# Altium schematic sheet GSM_GPS.SchDoc
size A4
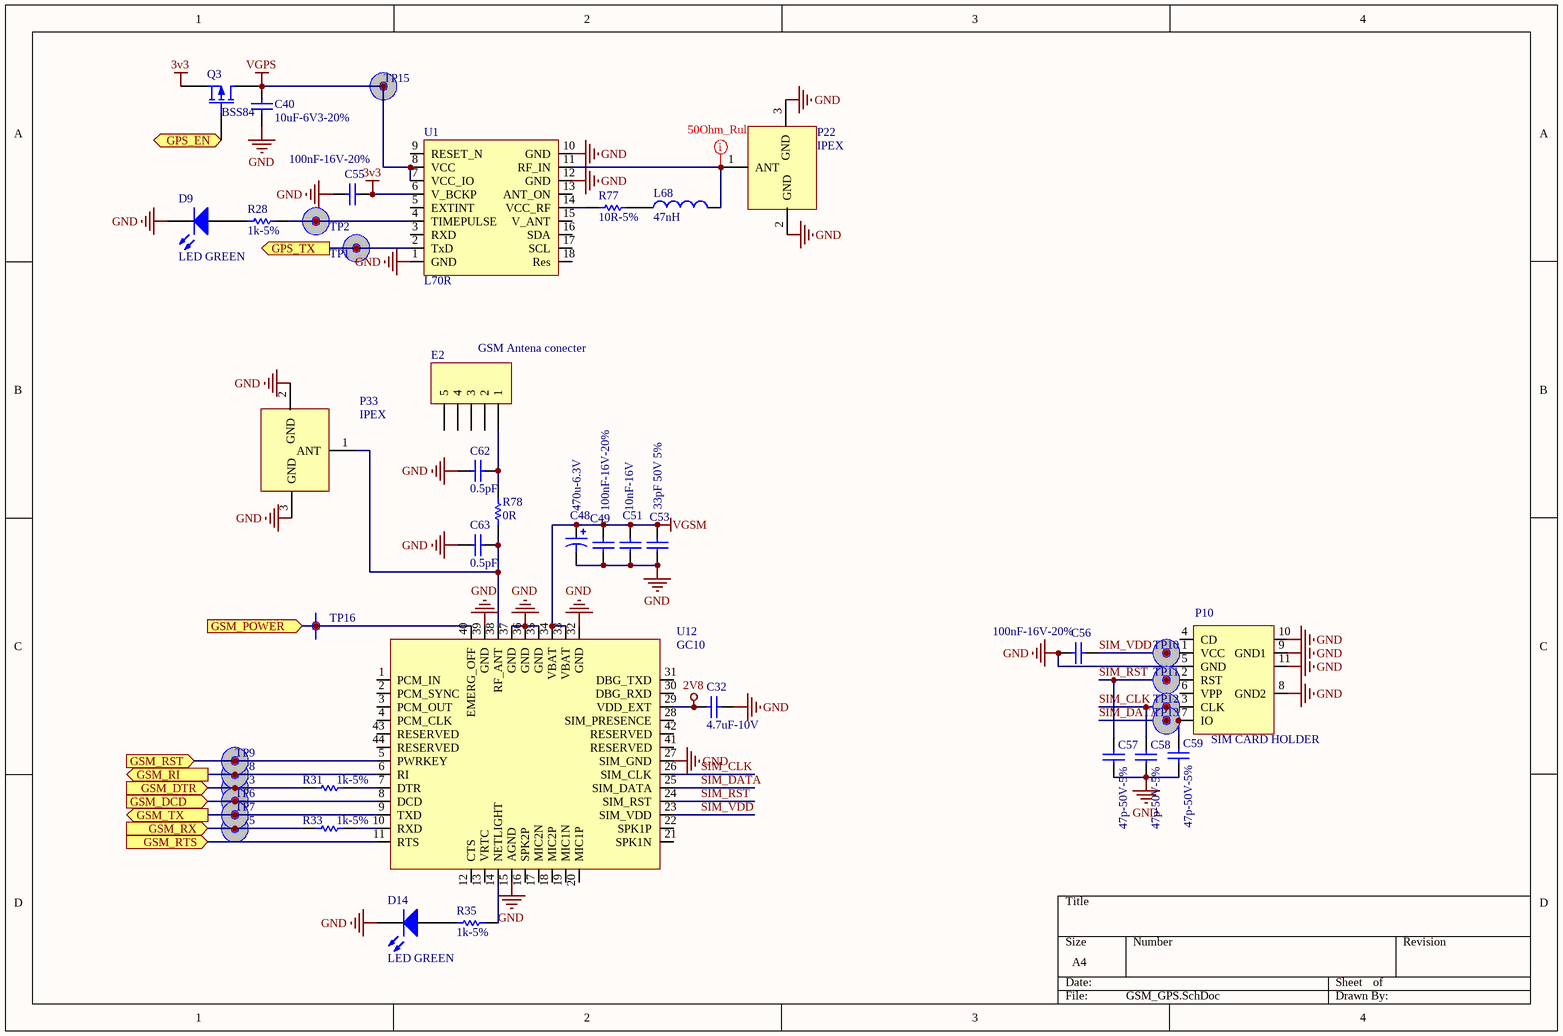
[diagram p0: GSM_GPS.SchDoc]

## Parts
C32  4.7uF-10V  [C0603]
C40  10uF-6V3-20%  [C0603]
C48  470u-6.3V  [C1812]
C49  100nF-16V-20%  [C0402]
C51  10nF-16V  [C0402]
C53  33pF 50V 5%  [C0402]
C55  100nF-16V-20%  [C0402]
C56  100nF-16V-20%  [C0402]
C57  47p-50V-5%  [C0402]
C58  47p-50V-5%  [C0402]
C59  47p-50V-5%  [C0402]
C62  0.5pF  [C0402]
C63  0.5pF  [C0402]
D9  LED GREEN  [LED0603-G]
D14  LED GREEN  [LED0603-G]
E2  GSM Antena conecter  [A10343-GSM850/900/1800/1900/WCDMA]
L68  47nH  [C0603]
P10  SIM CARD HOLDER  [SIM MF01-412-063X]
P22  IPEX  [IPEX]
P33  IPEX  [IPEX]
Q3  BSS84  [SOT23-3]
R28  1k-5%  [R0402]
R31  1k-5%  [R0402]
R33  1k-5%  [R0402]
R35  1k-5%  [R0402]
R77  10R-5%  [R0402]
R78  0R  [R0402]
TP1  TP  [test_point]  (value not drawn)
TP2  TP  [test_point]  (value not drawn)
TP3  TP  [test_point]  (value not drawn)
TP5  TP  [test_point]  (value not drawn)
TP6  TP  [test_point]  (value not drawn)
TP7  TP  [test_point]  (value not drawn)
TP8  TP  [test_point]  (value not drawn)
TP9  TP  [test_point]  (value not drawn)
TP10  TP  [test_point]  (value not drawn)
TP11  TP  [test_point]  (value not drawn)
TP12  TP  [test_point]  (value not drawn)
TP13  TP  [test_point]  (value not drawn)
TP15  TP  [test_point]  (value not drawn)
TP16  TP  [test_point]  (value not drawn)
U1  L70R  [MAX7]
U12  GC10  [GC10]

## Ports
GPS_EN (in), GPS_TX (out), GSM_DCD (in), GSM_DTR (in), GSM_POWER (in), GSM_RI (out), GSM_RST (in), GSM_RTS (in), GSM_RX (in), GSM_TX (out)

## Nets
2V8: C32.2 U12.29(VDD_EXT)
3v3: C55.1 Q3.2(S) U1.6(V_BCKP)
GND: C32.1 C40.1 C48.2 C49.2 C51.1 C53.2 C55.2 C56.2 C57.1 C58.1 C59.1 C62.1 C63.1 D9.2(K) D14.2(K) P10.5(GND) P10.8(GND2) P10.9(GND1) P10.10(GND3) P10.11(GND4) P22.2(GND) P22.3(GND) P33.2(GND) P33.3(GND) U1.1(GND) U1.10(GND) U1.12(GND) U12.15(AGND) U12.27(SIM_GND) U12.32(GND) U12.35(GND) U12.36(GND) U12.37(GND) U12.39(GND)
VGPS: C40.2 Q3.3(D) TP15.1(TP) U1.7(VCC_IO) U1.8(VCC)
VGSM: C48.1 C49.1 C51.2 C53.1 U12.33(VBAT) U12.34(VBAT)
GPS_EN: Q3.1(G) ; port GPS_EN
GPS_TX: TP1.1(TP) U1.2(TxD) ; port GPS_TX
GSM_DCD: TP6.1(TP) U12.8(DCD) ; port GSM_DCD
GSM_DTR: R31.2 TP3.1(TP) ; port GSM_DTR
GSM_POWER: TP16.1(TP) U12.40(EMERG_OFF) ; port GSM_POWER
GSM_RI: TP8.1(TP) U12.6(RI) ; port GSM_RI
GSM_RST: TP9.1(TP) U12.5(PWRKEY) ; port GSM_RST
GSM_RTS: U12.11(RTS) ; port GSM_RTS
GSM_RX: R33.2 TP5.1(TP) ; port GSM_RX
GSM_TX: TP7.1(TP) U12.9(TXD) ; port GSM_TX
SIM_CLK: C58.2 P10.3(CLK) TP12.1(TP) U12.26(SIM_CLK)
SIM_DATA: C59.2 P10.7(IO) TP13.1(TP) U12.25(SIM_DATA)
SIM_RST: C57.2 P10.2(RST) TP11.1(TP) U12.24(SIM_RST)
SIM_VDD: C56.1 P10.1(VCC) TP10.1(TP) U12.23(SIM_VDD)
NetC62_2: C62.2 E2.1 R78.2
NetC63_2: C63.2 P33.1(ANT) R78.1 U12.38(RF_ANT)
NetD9_1: D9.1(A) R28.2
NetD14_1: D14.1(A) R35.1
NetL68_1: L68.1 R77.1
NetL68_2: L68.2 P22.1(ANT) U1.11(RF_IN)
NetR28_1: R28.1 TP2.1(TP) U1.4(TIMEPULSE)
NetR31_1: R31.1 U12.7(DTR)
NetR33_1: R33.1 U12.10(RXD)
NetR35_2: R35.2 U12.14(NETLIGHT)
NetR77_2: R77.2 U1.14(VCC_RF)

Not connected (* = marked no-connect by the designer): E2 2 3 4 5; P10 4(CD) 6(VPP); U1 3(RXD) 5(EXTINT) 9(RESET_N) 13(ANT_ON) 15(V_ANT) 16(SDA) 17(SCL) 18(Res); U12 1(PCM_IN) 2(PCM_SYNC) 3(PCM_OUT) 4(PCM_CLK) 12(CTS) 13(VRTC) 16(SPK2P) 17(MIC2N) 18(MIC2P) 19(MIC1N) 20(MIC1P) 21(SPK1N) 22(SPK1P) 28(SIM_PRESENCE) 30(DBG_RXD) 31(DBG_TXD) 41(RESERVED) 42(RESERVED) 43(RESERVED) 44(RESERVED)

## Layout directives
rule Width Constraint [Pref Width = 26mil    Min Width = 26mil    Max Width = 26mil]; rule Clearance Constraint [Clearance = 10mil]: NetL68_2

## Library data of the parts
C32 = 4.7uF-10V-C0805: Non-Polarized Capacitor; Manufacturer: Yageo; Manufacturer Part Number: CC0805ZRY5V6BB475; Value: 4.7uF-10V; Digi-Key Part Number: 311-1371-1-ND; Unit Price: 0.1
C40 = Cap: CAP CER 10UF 6.3V 20% X5R 0603; Manufacturer: Murata Electronics North America; Manufacturer Part Number: GRM188R60J106ME47D; Published: 8-Jun-2000; LatestRevisionDate: 17-Jul-2002; LatestRevisionNote: Re-released for DXP Platform.; PackageReference: C0603; Publisher: Altium Limited; Value: 10uF-6V3-20%; Digi-Key Part Number: 490-3896-1-ND; Unit Price: 0.07873
C48 = Cap Pol3: CAP CER 100UF 10V 20% X5R 1812; Manufacturer Part Number: C4532X5R1A107M; Manufacturer: TDK Corporation; Published: 8-Jun-2000; LatestRevisionDate: 29-May-2009; LatestRevisionNote: IPC-7351 Footprint Added.; PackageReference: C0805; Publisher: Altium Limited; PackageDescription: Chip Capacitor; Digi-Key Part Number: 445-7743-2-ND; Unit Price: 0.55800
C49 C55 C56 = Cap: CAP CER 0.1UF 16V Y5V 0402; Manufacturer: Yageo; Manufacturer Part Number: CC0402ZRY5V7BB104; Published: 8-Jun-2000; LatestRevisionDate: 17-Jul-2002; LatestRevisionNote: Re-released for DXP Platform.; PackageReference: C0402; Publisher: Altium Limited; Value: 100nF-16V-20%; Digi-Key Part Number: 311-1047-1-ND; Unit Price: 0.00250
C51 = 10nF-16V-C0402-10%: CAP CER 10000PF 16V 10% X7R 0402; Manufacturer: Yageo; Manufacturer Part Number: CC0402KRX7R7BB103; Digi-Key Part Number: 311-1042-2-ND; Unit Price: 0.00216
C53 = Cap: CAP CER 68PF 50V 5% NPO 0402; Manufacturer: Yageo; Manufacturer Part Number: CC0402JRNPO9BN680; Digi-Key Part Number: 311-1340-2-ND; Unit Price: 10,000=0.00227
C57-C59 = Cap: CAP CER 47PF 50V 5% NPO 0402; Manufacturer: Yageo; Manufacturer Part Number: CC0402JRNPO9BN470; Published: 8-Jun-2000; LatestRevisionDate: 17-Jul-2002; LatestRevisionNote: Re-released for DXP Platform.; PackageReference: C0603; Publisher: Altium Limited; Value: 47p-50V-5%; Digi-Key Part Number: 311-1021-1-ND; Unit Price: 0.00270
C62 C63 = 0.5pF-50V-C0805: Non-Polarized Capacitor; Manufacturer: Yageo; Manufacturer Part Number: CC0805CRNPO9BNR50; Value: 0.5pF; Digi-Key Part Number: 311-1094-1-ND; Unit Price: 0.1
D9 D14 = LED2: LED GREEN CLEAR THIN 0603 SMD; Manufacturer: Lite-On Inc; Manufacturer Part Number: LTST-C191KGKT; Published: 8-Jun-2000; LatestRevisionDate: 17-Jul-2002; LatestRevisionNote: Re-released for DXP Platform.; PackageVersion: Feb-2002; PackageReference: 3.2X1.6X1.1; Publisher: Altium Limited; Digi-Key Part Number: 160-1446-2-ND; Unit Price: 0.03780; Value: LED GREEN
E2 = Header 5: Header, 5-Pin; LatestRevisionDate: 17-Jul-2002; LatestRevisionNote: Re-released for DXP Platform.; Publisher: Altium Limited
L68 = Inductor: Code_IEC: 1005; Published: 8-Jun-2000; LatestRevisionDate: 29-May-2009; LatestRevisionNote: IPC-7351 Footprint Added.; PackageReference: 0402-A; Publisher: Altium Limited; PackageDescription: Chip Inductor; Code_JEITA: 0402; Value: 47nH
P10 = SIM CARD: SIM _CONNECTOR_410108105011-2LF; Manufacturer: Tyrone
Q3 = MOSFET-P: MOSFET P-CH 50V 130MA SOT23-3; Manufacturer: Diodes Inc; Manufacturer Part Number: BSS84-7-F; Published: 8-Jun-2000; LatestRevisionDate: 17-Jul-2002; LatestRevisionNote: Re-released for DXP Platform.; PackageVersion: 1995/1996; PackageReference: E3; Publisher: Altium Limited; Digi-Key Part Number: BSS84-FDITR-ND; Unit Price: 0.06000
R28 R31 R33 R35 = Res1: RES 1.0K OHM 1/16W 5% 0402 SMD; Manufacturer: Yageo; Manufacturer Part Number: RC0402JR-071KL; Published: 8-Jun-2000; LatestRevisionDate: 17-Jul-2002; LatestRevisionNote: Re-released for DXP Platform.; PackageReference: R0603; Publisher: Altium Limited; Value: 1k-5%; Digi-Key Part Number: 311-1.0KJRCT-ND; Unit Price: 0.00178
R77 = 10R-5%-R0402: RES 10 OHM 1/16W 5% 0402 SMD; Manufacturer: Yageo; Manufacturer Part Number: RC0402JR-0710RL; Digi-Key Part Number: 311-10JRTR-ND; Unit Price: 0.00130
R78 = 0R-0805
U1 = MAX-7